# Altium schematic sheet MCU.SchDoc
size A2
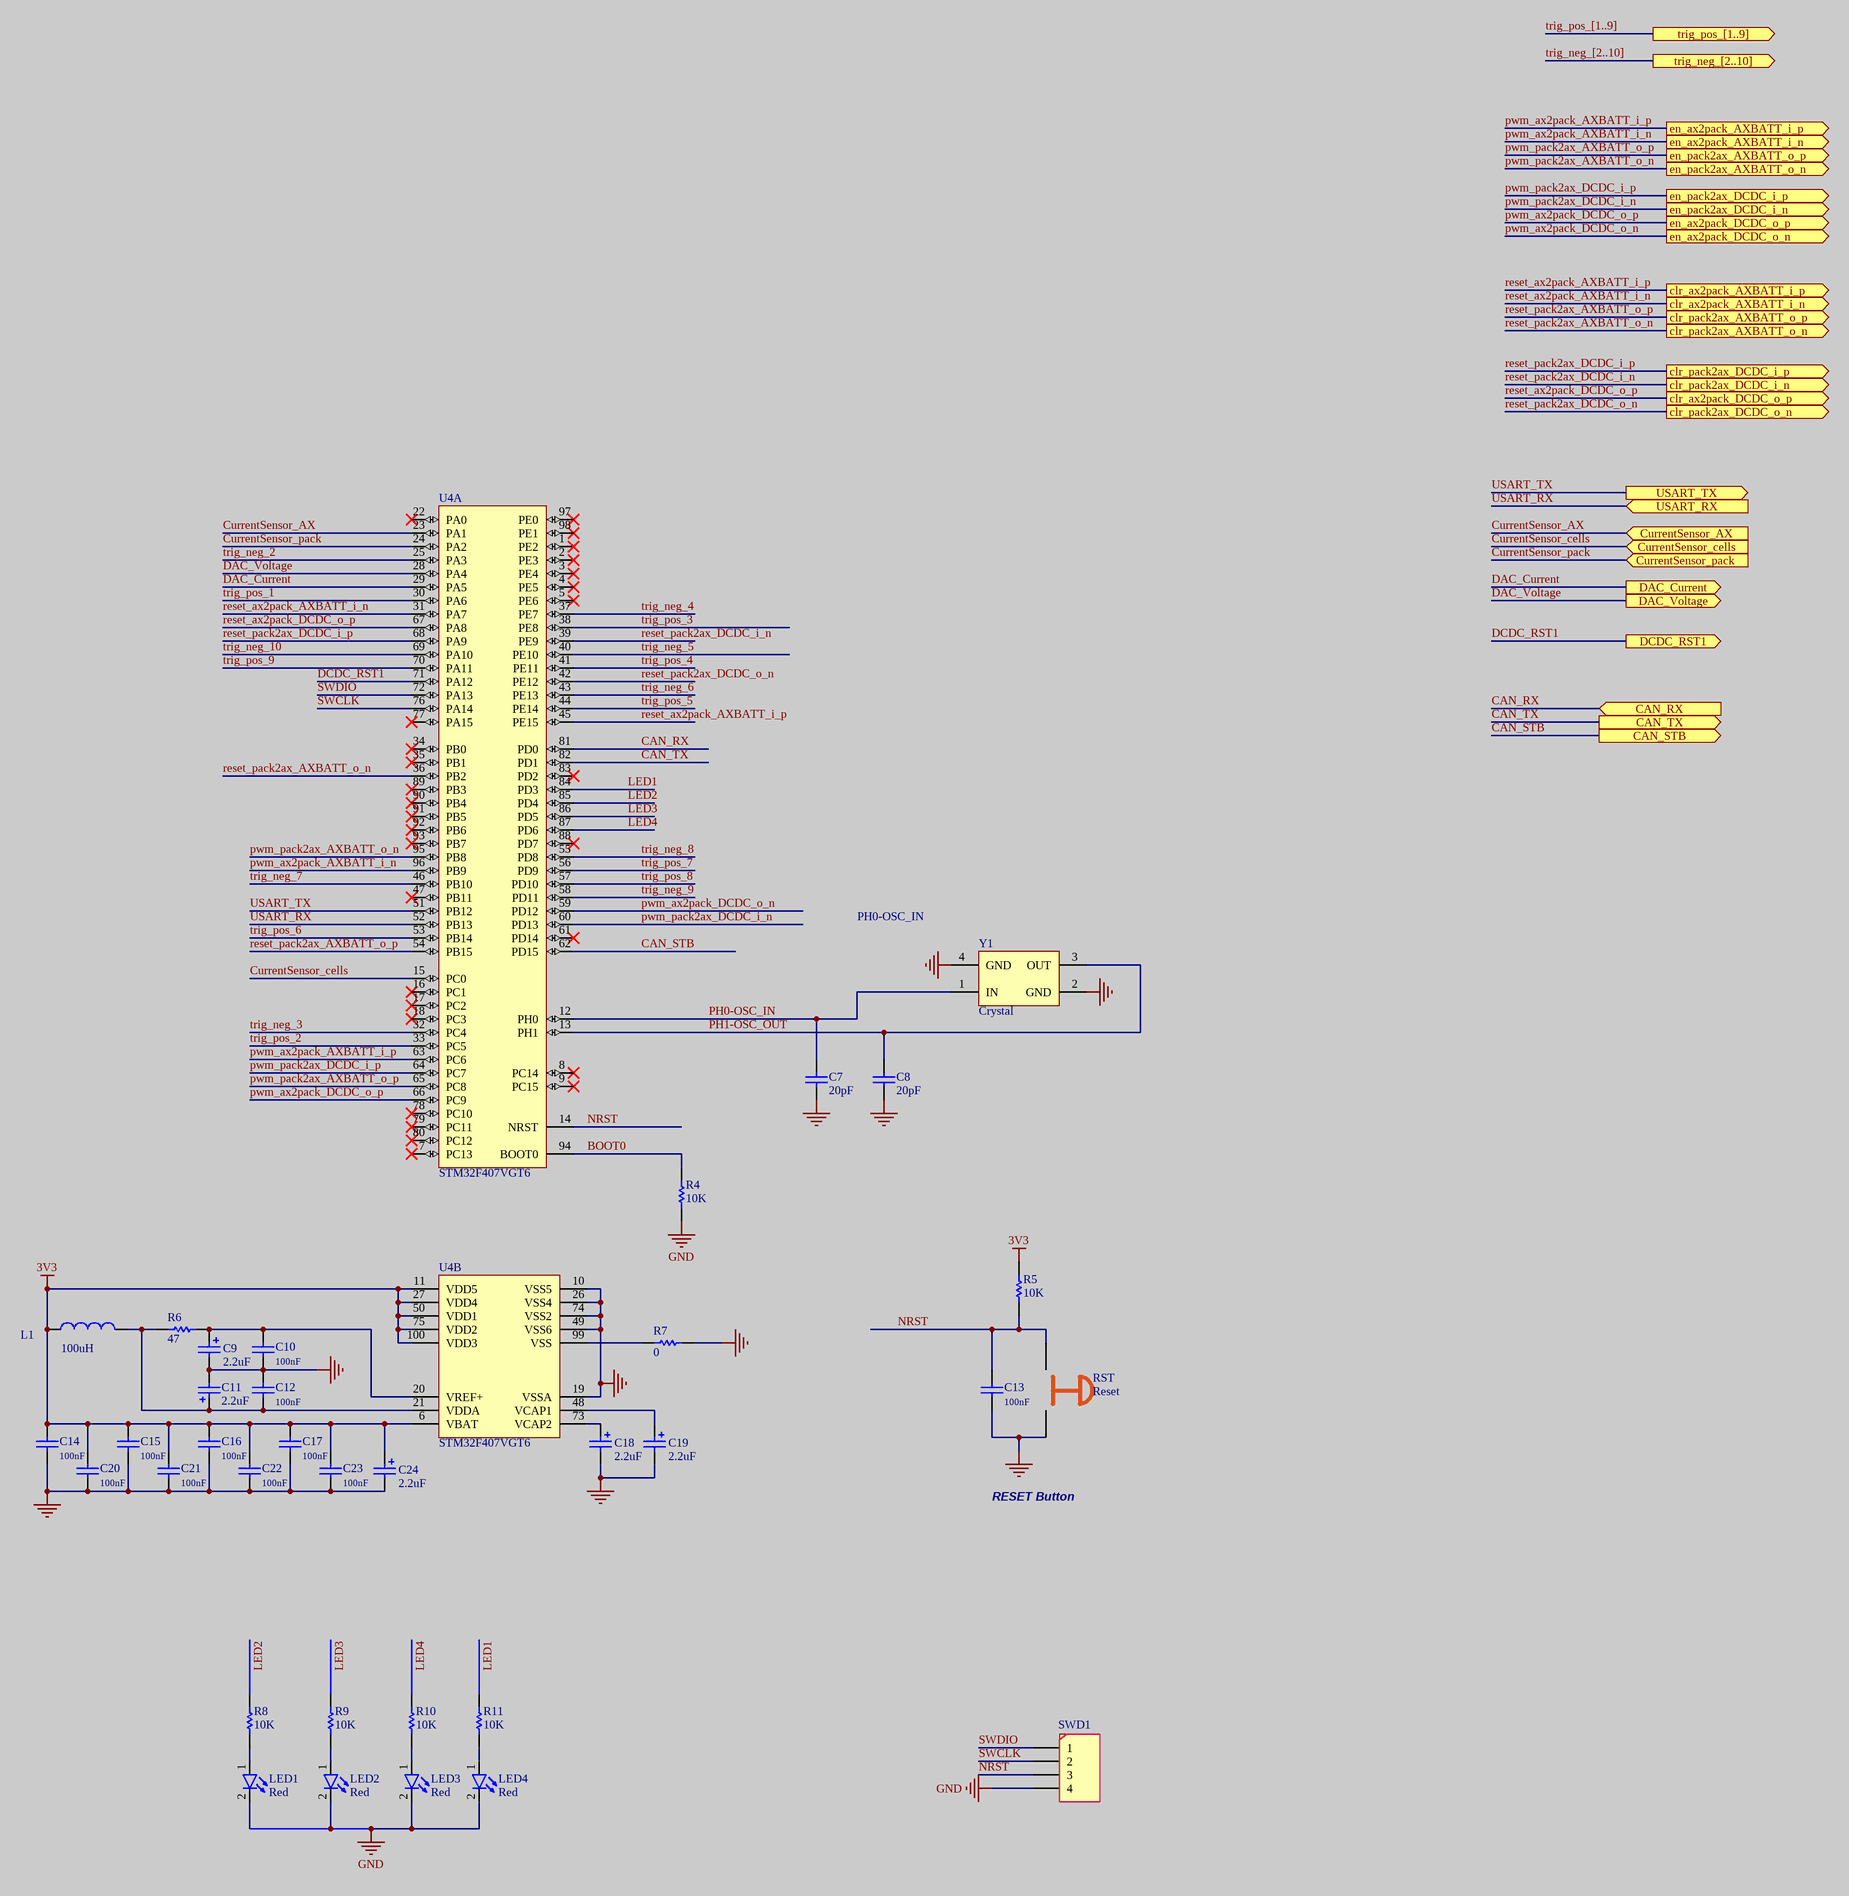
[diagram p0: MCU.SchDoc]

## Parts
C7  20pF  [CAPC0603]
C8  20pF  [CAPC0603]
C9  2.2uF  [C1206]
C10  100nF  [CAPC0603]
C11  2.2uF  [C1206]
C12  100nF  [CAPC0603]
C13  100nF  [CAPC0603]
C14  100nF  [CAPC0603]
C15  100nF  [CAPC0603]
C16  100nF  [CAPC0603]
C17  100nF  [CAPC0603]
C18  2.2uF  [C1206]
C19  2.2uF  [C1206]
C20  100nF  [CAPC0603]
C21  100nF  [CAPC0603]
C22  100nF  [CAPC0603]
C23  100nF  [CAPC0603]
C24  2.2uF  [C1206]
L1  100uH  [RES1206]
LED1  Red  [LED]
LED2  Red  [LED]
LED3  Red  [LED]
LED4  Red  [LED]
R4  10K  [RESC0603]
R5  10K  [RESC0603]
R6  47  [RESC0603]
R7  0  [RESC0603]
R8  10K  [RESC0603]
R9  10K  [RESC0603]
R10  10K  [RESC0603]
R11  10K  [RESC0603]
RST  Reset  [SWITCH-PB4]
SWD1  (no value)  [HEADER1*4]
U4  STM32F407VGT6  [QFP50P1600X1600X160-100N]  (parts A,B of 2)
Y1  Crystal  [ABM3B-8.000MHZ-B2]

## Ports
CAN_RX (in), CAN_STB (out), CAN_TX (out), clr_ax2pack_AXBATT_i_n (out), clr_ax2pack_AXBATT_i_p (out), clr_ax2pack_DCDC_o_p (out), clr_pack2ax_AXBATT_o_n (out), clr_pack2ax_AXBATT_o_p (out), clr_pack2ax_DCDC_i_n (out), clr_pack2ax_DCDC_i_p (out), clr_pack2ax_DCDC_o_n (out), CurrentSensor_AX (in), CurrentSensor_cells (in), CurrentSensor_pack (in), DAC_Current (out), DAC_Voltage (out), DCDC_RST1 (out), en_ax2pack_AXBATT_i_n (out), en_ax2pack_AXBATT_i_p (out), en_ax2pack_DCDC_o_n (out), en_ax2pack_DCDC_o_p (out), en_pack2ax_AXBATT_o_n (out), en_pack2ax_AXBATT_o_p (out), en_pack2ax_DCDC_i_n (out), en_pack2ax_DCDC_i_p (out), trig_neg_[2..10] (out), trig_pos_[1..9] (out), USART_RX (in), USART_TX (out)

## Nets
3V3: C14.1 C15.1 C16.1 C17.1 C20.1 C21.1 C22.1 C23.1 C24.1 L1.1 R5.2 U4.6(VBAT) U4.11(VDD5) U4.27(VDD4) U4.50(VDD1) U4.75(VDD2) U4.100(VDD3)
GND: C7.1 C8.1 C9.2 C10.2 C11.2 C12.1 C13.2 C14.2 C15.2 C16.2 C17.2 C18.2 C19.2 C20.2 C21.2 C22.2 C23.2 C24.2 LED1.2(K) LED2.2(K) LED3.2(K) LED4.2(K) R4.1 R7.1 RST.2 SWD1.4 U4.10(VSS5) U4.19(VSSA) U4.26(VSS4) U4.49(VSS6) U4.74(VSS2) Y1.2(GND) Y1.4(GND)
BOOT0: R4.2 U4.94(BOOT0)
CAN_RX: U4.81(PD0) ; port CAN_RX
CAN_STB: U4.62(PD15) ; port CAN_STB
CAN_TX: U4.82(PD1) ; port CAN_TX
CurrentSensor_AX: U4.23(PA1) ; port CurrentSensor_AX
CurrentSensor_cells: U4.15(PC0) ; port CurrentSensor_cells
CurrentSensor_pack: U4.24(PA2) ; port CurrentSensor_pack
DAC_Current: U4.29(PA5) ; port DAC_Current
DAC_Voltage: U4.28(PA4) ; port DAC_Voltage
DCDC_RST1: U4.71(PA12) ; port DCDC_RST1
LED1: R11.2 U4.84(PD3)
LED2: R8.2 U4.85(PD4)
LED3: R9.2 U4.86(PD5)
LED4: R10.2 U4.87(PD6)
NRST: C13.1 R5.1 RST.1 SWD1.3 U4.14(NRST)
PH0-OSC_IN: C7.2 U4.12(PH0) Y1.1(IN)
PH1-OSC_OUT: C8.2 U4.13(PH1) Y1.3(OUT)
pwm_ax2pack_AXBATT_i_n: U4.96(PB9) ; port en_ax2pack_AXBATT_i_n
pwm_ax2pack_AXBATT_i_p: U4.63(PC6) ; port en_ax2pack_AXBATT_i_p
pwm_ax2pack_DCDC_o_n: U4.59(PD12) ; port en_ax2pack_DCDC_o_n
pwm_ax2pack_DCDC_o_p: U4.66(PC9) ; port en_ax2pack_DCDC_o_p
pwm_pack2ax_AXBATT_o_n: U4.95(PB8) ; port en_pack2ax_AXBATT_o_n
pwm_pack2ax_AXBATT_o_p: U4.65(PC8) ; port en_pack2ax_AXBATT_o_p
pwm_pack2ax_DCDC_i_n: U4.60(PD13) ; port en_pack2ax_DCDC_i_n
pwm_pack2ax_DCDC_i_p: U4.64(PC7) ; port en_pack2ax_DCDC_i_p
reset_ax2pack_AXBATT_i_n: U4.31(PA7) ; port clr_ax2pack_AXBATT_i_n
reset_ax2pack_AXBATT_i_p: U4.45(PE15) ; port clr_ax2pack_AXBATT_i_p
reset_ax2pack_DCDC_o_p: U4.67(PA8) ; port clr_ax2pack_DCDC_o_p
reset_pack2ax_AXBATT_o_n: U4.36(PB2) ; port clr_pack2ax_AXBATT_o_n
reset_pack2ax_AXBATT_o_p: U4.54(PB15) ; port clr_pack2ax_AXBATT_o_p
reset_pack2ax_DCDC_i_n: U4.39(PE9) ; port clr_pack2ax_DCDC_i_n
reset_pack2ax_DCDC_i_p: U4.68(PA9) ; port clr_pack2ax_DCDC_i_p
reset_pack2ax_DCDC_o_n: U4.42(PE12) ; port clr_pack2ax_DCDC_o_n
SWCLK: SWD1.2 U4.76(PA14)
SWDIO: SWD1.1 U4.72(PA13)
trig_neg_2: U4.25(PA3)
trig_neg_3: U4.32(PC4)
trig_neg_4: U4.37(PE7)
trig_neg_5: U4.40(PE10)
trig_neg_6: U4.43(PE13)
trig_neg_7: U4.46(PB10)
trig_neg_8: U4.55(PD8)
trig_neg_9: U4.58(PD11)
trig_neg_10: U4.69(PA10)
trig_pos_1: U4.30(PA6)
trig_pos_2: U4.33(PC5)
trig_pos_3: U4.38(PE8)
trig_pos_4: U4.41(PE11)
trig_pos_5: U4.44(PE14)
trig_pos_6: U4.53(PB14)
trig_pos_7: U4.56(PD9)
trig_pos_8: U4.57(PD10)
trig_pos_9: U4.70(PA11)
USART_RX: U4.52(PB13) ; port USART_RX
USART_TX: U4.51(PB12) ; port USART_TX
NetC9_1: C9.1 C10.1 R6.1 U4.20(VREF+)
NetC11_1: C11.1 C12.2 L1.2 R6.2 U4.21(VDDA)
NetC18_1: C18.1 U4.73(VCAP2)
NetC19_1: C19.1 U4.48(VCAP1)
NetLED1_1: LED1.1(A) R8.1
NetLED2_1: LED2.1(A) R9.1
NetLED3_1: LED3.1(A) R10.1
NetLED4_1: LED4.1(A) R11.1
NetR7_2: R7.2 U4.99(VSS)

Not connected (* = marked no-connect by the designer): U4 1(PE2)* 2(PE3)* 3(PE4)* 4(PE5)* 5(PE6)* 7(PC13)* 8(PC14)* 9(PC15)* 16(PC1)* 17(PC2)* 18(PC3)* 22(PA0)* 34(PB0)* 35(PB1)* 47(PB11)* 61(PD14)* 77(PA15)* 78(PC10)* 79(PC11)* 80(PC12)* 83(PD2)* 88(PD7)* 89(PB3)* 90(PB4)* 91(PB5)* 92(PB6)* 93(PB7)* 97(PE0)* 98(PE1)*

## Buses and harness runs
bus trig_neg_[2..10] = port trig_neg_[2..10]
bus trig_pos_[1..9] = port trig_pos_[1..9]

## Notes on the sheet
- PH0-OSC_IN
- RESET Button

## Library data of the parts
C7 C8 C10 C12-C17 C20-C23 = Capacitor: Published: 8-Jun-2000; LatestRevisionDate: 17-Jul-2002; LatestRevisionNote: Re-released for DXP Platform.; PackageReference: C0805; Publisher: Altium Limited
  C7 C8: Value: 20pF
  C10 C12-C17 C20-C23: Value: 100nF
C9 C11 C18 C19 C24 = Cap_Tan: Tantalium Capacitor Size C; Published: 8-Jun-2000; LatestRevisionDate: 17-Jul-2002; LatestRevisionNote: Re-released for DXP Platform.; PackageReference: C0805; Publisher: Altium Limited
L1 = INDUCTOR: Value: 68uH; Code_IEC: 1005; Published: 8-Jun-2000; Publisher: Altium Limited; LatestRevisionDate: 17-Jul-2002; LatestRevisionNote: Re-released for DXP Platform.; PackageReference: 0402-A; Code_JEITA: 0402
LED1-LED4 = LED: Designer: Saeid Jorablo; Organazation: ControTec; Adding Date: 1387/12/22; Color: Red; Size: SMD 0603
R4-R11 = Resistor: 0603,0.1W; Published: 8-Jun-2000; LatestRevisionDate: 17-Jul-2002; LatestRevisionNote: Re-released for DXP Platform.; PackageReference: AXIAL-0.5; Publisher: Altium Limited
  R4 R5 R8-R11: Value: 10K
  R6: Value: 47
  R7: Value: 0
RST = Swtich-PB4: 4-Pin Push Button
SWD1 = Header1*4: Header, 4-Pin
U4 = STM32H743: STM32 Manta (STM32F407VGT6); Manuf_1: STM; Provided: ST; Ref St: 9175122; ECCN_US/EU: 3A991A2/NEC; Manuf_Part_1: STM32F407VGT6; Distrib: ST; Footprint: QFP100
Y1 = Crystal: ABM3B-8.000MHZ-B2